# Altium project P-MT3620RDB-1-7.PrjPcb (part 5 of 5)
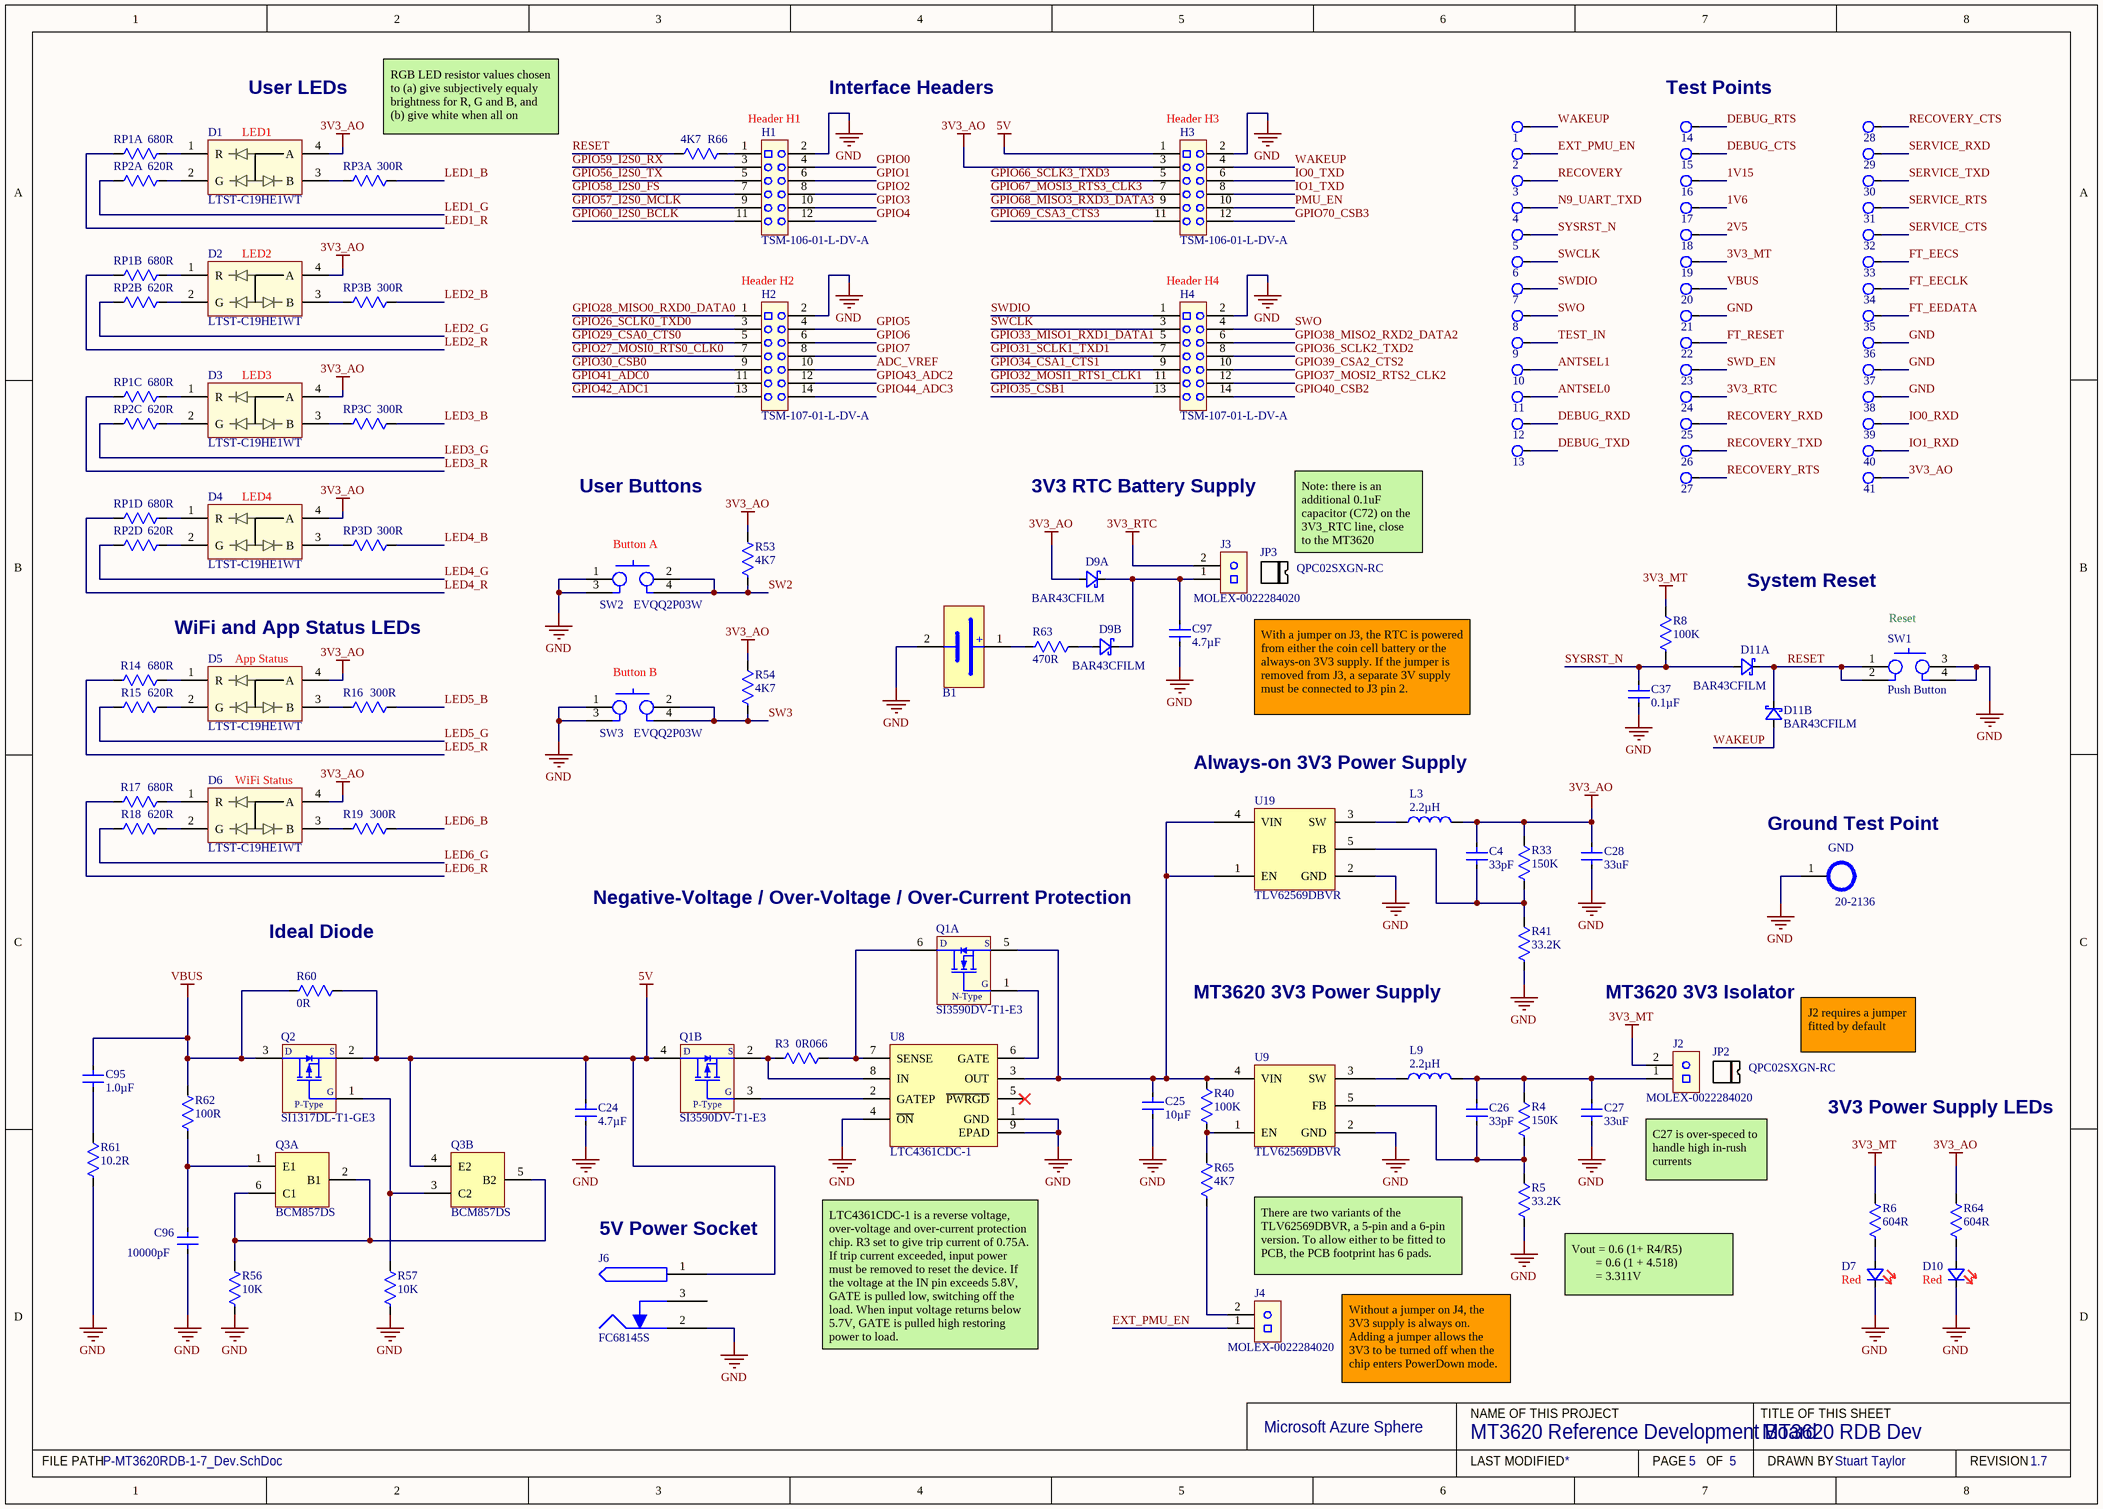
[diagram p7: P-MT3620RDB-1-7_Dev.SchDoc]

## Nets that join several sheets
3V3_AO: P-MT3620RDB-1-7_FTDI (21 pins), P-MT3620RDB-1-7_Dev (16 pins)
3V3_MT: P-MT3620RDB-1-7_WiFi (C14.2 U4.2), P-MT3620RDB-1-7_PIO (R20.1 R22.1 U1.157), P-MT3620RDB-1-7_PMU (33 pins), P-MT3620RDB-1-7_Dev (19.1 J2.2 R6.1 R8.1)
3V3_RTC: P-MT3620RDB-1-7_PIO (R43.2), P-MT3620RDB-1-7_PMU (C72.2 U1.71), P-MT3620RDB-1-7_Dev (24.1 J3.2)
GND: P-MT3620RDB-1-7_WiFi (37 pins), P-MT3620RDB-1-7_PIO (12 pins), P-MT3620RDB-1-7_PMU (44 pins), P-MT3620RDB-1-7_FTDI (41 pins), P-MT3620RDB-1-7_Dev (36 pins)
VBUS: P-MT3620RDB-1-7_FTDI (J5.1 U12.6), P-MT3620RDB-1-7_Dev (5 pins)
1V6: P-MT3620RDB-1-7_PMU (11 pins), P-MT3620RDB-1-7_Dev (17.1)
1V15: P-MT3620RDB-1-7_PMU (20 pins), P-MT3620RDB-1-7_Dev (16.1)
2V5: P-MT3620RDB-1-7_PMU (5 pins), P-MT3620RDB-1-7_Dev (18.1)
ADC_VREF: P-MT3620RDB-1-7_PMU (C85.2 J1.1 U1.67), P-MT3620RDB-1-7_Dev (H2.10)
ANTSEL0: P-MT3620RDB-1-7_WiFi (R39.1 U1.11), P-MT3620RDB-1-7_Dev (11.1)
ANTSEL1: P-MT3620RDB-1-7_WiFi (R37.1 U1.12), P-MT3620RDB-1-7_Dev (10.1)
DEBUG_CTS: P-MT3620RDB-1-7_PIO (U1.97), P-MT3620RDB-1-7_FTDI (U16.18), P-MT3620RDB-1-7_Dev (15.1)
DEBUG_RTS: P-MT3620RDB-1-7_PIO (U1.96), P-MT3620RDB-1-7_FTDI (R35.1 U16.19), P-MT3620RDB-1-7_Dev (14.1)
DEBUG_RXD: P-MT3620RDB-1-7_PIO (U1.94), P-MT3620RDB-1-7_FTDI (U16.16), P-MT3620RDB-1-7_Dev (12.1)
DEBUG_TXD: P-MT3620RDB-1-7_PIO (R24.2 U1.95), P-MT3620RDB-1-7_FTDI (U16.17), P-MT3620RDB-1-7_Dev (13.1)
EXT_PMU_EN: P-MT3620RDB-1-7_PIO (U1.69), P-MT3620RDB-1-7_Dev (2.1 J4.1)
FT_EECLK: P-MT3620RDB-1-7_FTDI (R29.2 U14.4 U16.62 U17.1), P-MT3620RDB-1-7_Dev (34.1)
FT_EECS: P-MT3620RDB-1-7_FTDI (R28.2 U14.5 U16.63), P-MT3620RDB-1-7_Dev (33.1)
FT_EEDATA: P-MT3620RDB-1-7_FTDI (R26.2 U14.3 U16.61 U17.2), P-MT3620RDB-1-7_Dev (35.1)
FT_RESET: P-MT3620RDB-1-7_FTDI (R31.2 U16.14), P-MT3620RDB-1-7_Dev (22.1)
GPIO0: P-MT3620RDB-1-7_PIO (U1.13), P-MT3620RDB-1-7_Dev (H1.4)
GPIO1: P-MT3620RDB-1-7_PIO (U1.14), P-MT3620RDB-1-7_Dev (H1.6)
GPIO2: P-MT3620RDB-1-7_PIO (U1.15), P-MT3620RDB-1-7_Dev (H1.8)
GPIO3: P-MT3620RDB-1-7_PIO (U1.16), P-MT3620RDB-1-7_Dev (H1.10)
GPIO4: P-MT3620RDB-1-7_PIO (U1.17), P-MT3620RDB-1-7_Dev (H1.12)
GPIO5: P-MT3620RDB-1-7_PIO (U1.18), P-MT3620RDB-1-7_Dev (H2.4)
GPIO6: P-MT3620RDB-1-7_PIO (U1.19), P-MT3620RDB-1-7_Dev (H2.6)
GPIO7: P-MT3620RDB-1-7_PIO (U1.20), P-MT3620RDB-1-7_Dev (H2.8)
GPIO26_SCLK0_TXD0: P-MT3620RDB-1-7_PIO (U1.39), P-MT3620RDB-1-7_Dev (H2.3)
GPIO27_MOSI0_RTS0_CLK0: P-MT3620RDB-1-7_PIO (U1.40), P-MT3620RDB-1-7_Dev (H2.7)
GPIO28_MISO0_RXD0_DATA0: P-MT3620RDB-1-7_PIO (U1.42), P-MT3620RDB-1-7_Dev (H2.1)
GPIO29_CSA0_CTS0: P-MT3620RDB-1-7_PIO (U1.43), P-MT3620RDB-1-7_Dev (H2.5)
GPIO30_CSB0: P-MT3620RDB-1-7_PIO (U1.45), P-MT3620RDB-1-7_Dev (H2.9)
GPIO31_SCLK1_TXD1: P-MT3620RDB-1-7_PIO (U1.46), P-MT3620RDB-1-7_Dev (H4.7)
GPIO32_MOSI1_RTS1_CLK1: P-MT3620RDB-1-7_PIO (U1.47), P-MT3620RDB-1-7_Dev (H4.11)
GPIO33_MISO1_RXD1_DATA1: P-MT3620RDB-1-7_PIO (U1.48), P-MT3620RDB-1-7_Dev (H4.5)
GPIO34_CSA1_CTS1: P-MT3620RDB-1-7_PIO (U1.49), P-MT3620RDB-1-7_Dev (H4.9)
GPIO35_CSB1: P-MT3620RDB-1-7_PIO (U1.50), P-MT3620RDB-1-7_Dev (H4.13)
GPIO36_SCLK2_TXD2: P-MT3620RDB-1-7_PIO (U1.51), P-MT3620RDB-1-7_Dev (H4.8)
GPIO37_MOSI2_RTS2_CLK2: P-MT3620RDB-1-7_PIO (U1.52), P-MT3620RDB-1-7_Dev (H4.12)
GPIO38_MISO2_RXD2_DATA2: P-MT3620RDB-1-7_PIO (U1.53), P-MT3620RDB-1-7_Dev (H4.6)
GPIO39_CSA2_CTS2: P-MT3620RDB-1-7_PIO (U1.54), P-MT3620RDB-1-7_Dev (H4.10)
GPIO40_CSB2: P-MT3620RDB-1-7_PIO (U1.55), P-MT3620RDB-1-7_Dev (H4.14)
GPIO41_ADC0: P-MT3620RDB-1-7_PIO (U1.58), P-MT3620RDB-1-7_Dev (H2.11)
GPIO42_ADC1: P-MT3620RDB-1-7_PIO (U1.59), P-MT3620RDB-1-7_Dev (H2.13)
GPIO43_ADC2: P-MT3620RDB-1-7_PIO (U1.60), P-MT3620RDB-1-7_Dev (H2.12)
GPIO44_ADC3: P-MT3620RDB-1-7_PIO (U1.61), P-MT3620RDB-1-7_Dev (H2.14)
GPIO56_I2S0_TX: P-MT3620RDB-1-7_PIO (U1.101), P-MT3620RDB-1-7_Dev (H1.5)
GPIO57_I2S0_MCLK: P-MT3620RDB-1-7_PIO (U1.102), P-MT3620RDB-1-7_Dev (H1.9)
GPIO58_I2S0_FS: P-MT3620RDB-1-7_PIO (U1.103), P-MT3620RDB-1-7_Dev (H1.7)
GPIO59_I2S0_RX: P-MT3620RDB-1-7_PIO (U1.104), P-MT3620RDB-1-7_Dev (H1.3)
GPIO60_I2S0_BCLK: P-MT3620RDB-1-7_PIO (U1.105), P-MT3620RDB-1-7_Dev (H1.11)
GPIO66_SCLK3_TXD3: P-MT3620RDB-1-7_PIO (U1.113), P-MT3620RDB-1-7_Dev (H3.5)
GPIO67_MOSI3_RTS3_CLK3: P-MT3620RDB-1-7_PIO (U1.114), P-MT3620RDB-1-7_Dev (H3.7)
GPIO68_MISO3_RXD3_DATA3: P-MT3620RDB-1-7_PIO (U1.115), P-MT3620RDB-1-7_Dev (H3.9)
GPIO69_CSA3_CTS3: P-MT3620RDB-1-7_PIO (U1.116), P-MT3620RDB-1-7_Dev (H3.11)
GPIO70_CSB3: P-MT3620RDB-1-7_PIO (U1.117), P-MT3620RDB-1-7_Dev (H3.12)
IO0_RXD: P-MT3620RDB-1-7_PIO (U1.138), P-MT3620RDB-1-7_Dev (39.1)
IO0_TXD: P-MT3620RDB-1-7_PIO (R23.2 U1.139), P-MT3620RDB-1-7_Dev (H3.6)
IO1_RXD: P-MT3620RDB-1-7_PIO (U1.142), P-MT3620RDB-1-7_Dev (40.1)
IO1_TXD: P-MT3620RDB-1-7_PIO (R9.2 U1.143), P-MT3620RDB-1-7_Dev (H3.8)
LED1_B: P-MT3620RDB-1-7_PIO (U1.25), P-MT3620RDB-1-7_Dev (RP3.2)
LED1_G: P-MT3620RDB-1-7_PIO (U1.22), P-MT3620RDB-1-7_Dev (RP2.2)
LED1_R: P-MT3620RDB-1-7_PIO (U1.21), P-MT3620RDB-1-7_Dev (RP1.2)
LED2_B: P-MT3620RDB-1-7_PIO (U1.32), P-MT3620RDB-1-7_Dev (RP3.4)
LED2_G: P-MT3620RDB-1-7_PIO (U1.31), P-MT3620RDB-1-7_Dev (RP2.4)
LED2_R: P-MT3620RDB-1-7_PIO (U1.30), P-MT3620RDB-1-7_Dev (RP1.4)
LED3_B: P-MT3620RDB-1-7_PIO (U1.35), P-MT3620RDB-1-7_Dev (RP3.6)
LED3_G: P-MT3620RDB-1-7_PIO (U1.34), P-MT3620RDB-1-7_Dev (RP2.6)
LED3_R: P-MT3620RDB-1-7_PIO (U1.33), P-MT3620RDB-1-7_Dev (RP1.6)
LED4_B: P-MT3620RDB-1-7_PIO (U1.38), P-MT3620RDB-1-7_Dev (RP3.8)
LED4_G: P-MT3620RDB-1-7_PIO (U1.37), P-MT3620RDB-1-7_Dev (RP2.8)
LED4_R: P-MT3620RDB-1-7_PIO (U1.36), P-MT3620RDB-1-7_Dev (RP1.8)
LED5_B: P-MT3620RDB-1-7_PIO (U1.64), P-MT3620RDB-1-7_Dev (R16.1)
LED5_G: P-MT3620RDB-1-7_PIO (U1.63), P-MT3620RDB-1-7_Dev (R15.2)
LED5_R: P-MT3620RDB-1-7_PIO (U1.62), P-MT3620RDB-1-7_Dev (R14.2)
LED6_B: P-MT3620RDB-1-7_PIO (U1.26), P-MT3620RDB-1-7_Dev (R19.1)
LED6_G: P-MT3620RDB-1-7_PIO (U1.29), P-MT3620RDB-1-7_Dev (R18.2)
LED6_R: P-MT3620RDB-1-7_PIO (U1.65), P-MT3620RDB-1-7_Dev (R17.2)
N9_UART_TXD: P-MT3620RDB-1-7_PIO (U1.147), P-MT3620RDB-1-7_Dev (4.1)
PMU_EN: P-MT3620RDB-1-7_PIO (R42.2 U1.81), P-MT3620RDB-1-7_Dev (H3.10)
RECOVERY: P-MT3620RDB-1-7_FTDI (R35.2 R38.1 U16.57), P-MT3620RDB-1-7_Dev (3.1)
RECOVERY_CTS: P-MT3620RDB-1-7_PIO (U1.137), P-MT3620RDB-1-7_FTDI (U16.53), P-MT3620RDB-1-7_Dev (28.1)
RECOVERY_RTS: P-MT3620RDB-1-7_PIO (R21.2 U1.136), P-MT3620RDB-1-7_FTDI (U16.54), P-MT3620RDB-1-7_Dev (27.1)
RECOVERY_RXD: P-MT3620RDB-1-7_PIO (U1.134), P-MT3620RDB-1-7_FTDI (U16.48), P-MT3620RDB-1-7_Dev (25.1)
RECOVERY_TXD: P-MT3620RDB-1-7_PIO (R20.2 U1.135), P-MT3620RDB-1-7_FTDI (U16.52), P-MT3620RDB-1-7_Dev (26.1)
RESET: P-MT3620RDB-1-7_FTDI (R7.2 R36.2), P-MT3620RDB-1-7_Dev (D11.3 R66.1 SW1.1 SW1.2)
SERVICE_CTS: P-MT3620RDB-1-7_PIO (R55.1), P-MT3620RDB-1-7_FTDI (U16.40), P-MT3620RDB-1-7_Dev (32.1)
SERVICE_RTS: P-MT3620RDB-1-7_PIO (U1.128), P-MT3620RDB-1-7_FTDI (U16.41), P-MT3620RDB-1-7_Dev (31.1)
SERVICE_RXD: P-MT3620RDB-1-7_PIO (U1.129), P-MT3620RDB-1-7_FTDI (U16.38), P-MT3620RDB-1-7_Dev (29.1)
SERVICE_TXD: P-MT3620RDB-1-7_PIO (U1.127), P-MT3620RDB-1-7_FTDI (U16.39), P-MT3620RDB-1-7_Dev (30.1)
SW2: P-MT3620RDB-1-7_PIO (U1.27), P-MT3620RDB-1-7_Dev (R53.2 SW2.2 SW2.4)
SW3: P-MT3620RDB-1-7_PIO (U1.28), P-MT3620RDB-1-7_Dev (R54.2 SW3.2 SW3.4)
SWCLK: P-MT3620RDB-1-7_PIO (U1.99), P-MT3620RDB-1-7_FTDI (R46.1), P-MT3620RDB-1-7_Dev (6.1 H4.3)
SWD_EN: P-MT3620RDB-1-7_FTDI (5 pins), P-MT3620RDB-1-7_Dev (23.1)
SWDIO: P-MT3620RDB-1-7_PIO (U1.98), P-MT3620RDB-1-7_FTDI (R44.1 U18.5), P-MT3620RDB-1-7_Dev (7.1 H4.1)
SWO: P-MT3620RDB-1-7_PIO (U1.100), P-MT3620RDB-1-7_Dev (8.1 H4.4)
SYSRST_N: P-MT3620RDB-1-7_PIO (U1.125), P-MT3620RDB-1-7_Dev (5.1 C37.2 D11.1 R8.2)
TEST_IN: P-MT3620RDB-1-7_PIO (R51.1 U1.148), P-MT3620RDB-1-7_Dev (9.1)
WAKEUP: P-MT3620RDB-1-7_PIO (R43.1 U1.70), P-MT3620RDB-1-7_Dev (1.1 D11.2 H3.4)

## Assembly variants
Production P-MT3620RDB-1-7: not fitted C2 C3 C6 C7 C8 C9 C10 C12 C15 C16 C18 C19 C21 C22 C43 L5 R40 R60
Production P-MT3620RDB-1-7 (93LC66): not fitted C2 C3 C6 C7 C8 C9 C10 C12 C15 C16 C18 C19 C21 C22 C43 L5 R40 R60; alternate parts U14 -> 93LC66BT-I/OT
Production P-MT3620RDB-1-7 (93LC46): not fitted C2 C3 C6 C7 C8 C9 C10 C12 C15 C16 C18 C19 C21 C22 C43 L5 R40 R60; alternate parts U14 -> 93LC46BT-I/OT